# Altium schematic sheet ControllableSource1.SchDoc
size A4; DocumentNumber: 1; SheetNumber: 1; SheetTotal: 1
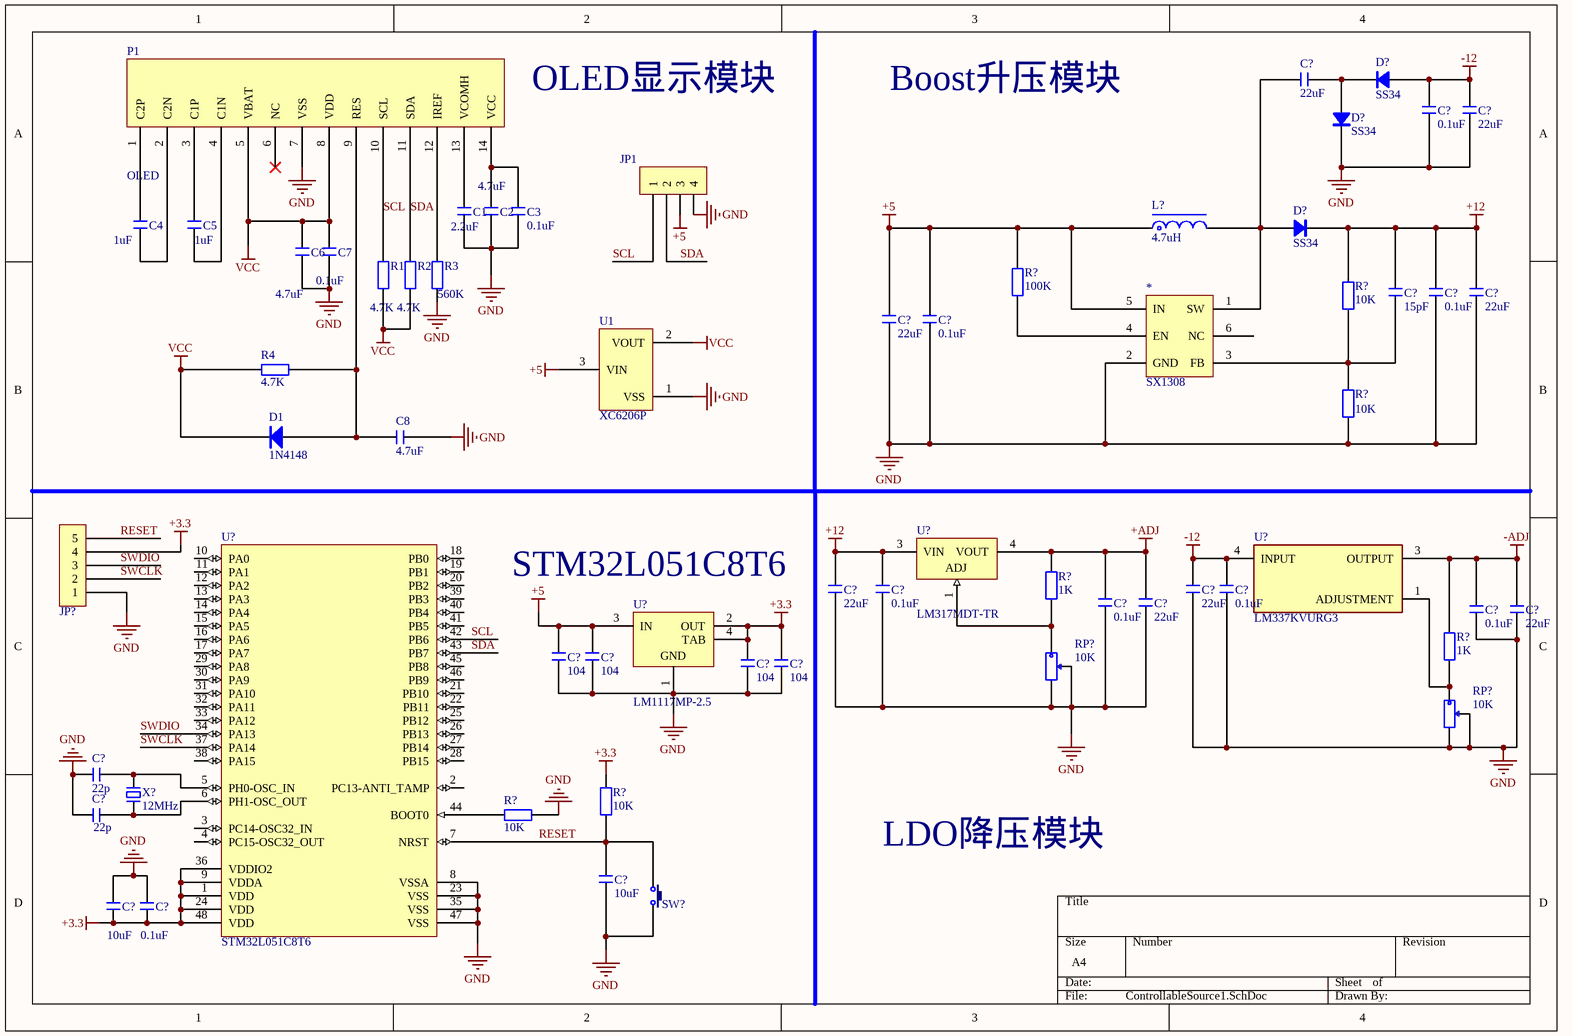
[diagram p0: ControllableSource1.SchDoc]

## Parts
(Parts that share a designator on the sheet are numbered #1, #2 ... from top to bottom, then left to right.)
*  SX1308  [SOT23-6N]
C1  2.2uF  [C 0805_L]
C2  4.7uF  [C 0805_L]
C3  0.1uF  [C 0805_L]
C4  1uF  [C 0805_L]
C5  1uF  [C 0805_L]
C6  4.7uF  [C 0805_L]
C7  0.1uF  [C 0805_L]
C8  4.7uF  [C 0805_L]
C?#1  22uF  [C 0805_L]
C?#2  0.1uF  [C 0805_L]
C?#3  22uF  [C 0805_L]
C?#4  15pF  [C 0805_L]
C?#5  0.1uF  [C 0805_L]
C?#6  22uF  [C 0805_L]
C?#7  22uF  [C 0805_L]
C?#8  0.1uF  [C 0805_L]
C?#9  22uF  [C 0805_L]
C?#10  0.1uF  [C 0805_L]
C?#11  22uF  [C 0805_L]
C?#12  0.1uF  [C 0805_L]
C?#13  0.1uF  [C 0805_L]
C?#14  22uF  [C 0805_L]
C?#15  0.1uF  [C 0805_L]
C?#16  22uF  [C 0805_L]
C?#17  104  [C 0805_L]
C?#18  104  [C 0805_L]
C?#19  104  [C 0805_L]
C?#20  104  [C 0805_L]
C?#21  22p  [C 0805_L]
C?#22  22p  [C 0805_L]
C?#23  10uF  [C 0805_L]
C?#24  10uF  [C 0805_L]
C?#25  0.1uF  [C 0805_L]
D1  1N4148  [MINI_MELF (LL34)]
D?#1  SS34  [SMC]
D?#2  SS34  [SMC]
D?#3  SS34  [SMC]
JP1  HDR-1X4  [XH2.54-WI-4P]  (value not drawn)
JP?  HDR-1X5  [XH2.54-WI-5P]  (value not drawn)
L?  4.7uH  [CD31]
P1  OLED  [OLED]
R1  4.7K  [R 0805_L]
R2  4.7K  [R 0805_L]
R3  560K  [R 0805_L]
R4  4.7K  [R 0805_L]
R?#1  100K  [R 0805_L]
R?#2  10K  [R 0805_L]
R?#3  10K  [R 0805_L]
R?#4  1K  [R 0805_L]
R?#5  1K  [R 0805_L]
R?#6  10K  [R 0805_L]
R?#7  10K  [R 0805_L]
RP?#1  10K  [3303W]
RP?#2  10K  [3303W]
SW?  3x6x5  [TSW SMD-3*6*2.5]  (value not drawn)
U1  XC6206P  [SOT23-3M]
U?#1  LM317MDT-TR  [TO-252_L]
U?#2  STM32L051C8T6  [STM-LQFP48_L]
U?#3  LM337KVURG3  [FP-KVU0003A-MFG]
U?#4  LM1117MP-2.5  [MP04A_L]
X?  12MHz  [OSC HC-49S]

## Nets
+3.3: C?#19.2 C?#20.2 C?#24.1 C?#25.1 JP?.4 R?#7.2 U?#2.1(VDD) U?#2.9(VDDA) U?#2.24(VDD) U?#2.36(VDDIO2) U?#2.48(VDD) U?#4.2(OUT) U?#4.4(TAB)
+5: *.5(IN) C?#7.2 C?#8.2 C?#17.2 C?#18.2 JP1.3 L?.1 R?#1.2 U1.3(VIN) U?#4.3(IN)
+12: C?#4.2 C?#5.2 C?#6.2 C?#9.2 C?#10.2 D?#3.2(K) R?#2.2 U?#1.3(VIN)
+ADJ: C?#13.2 C?#14.2 R?#4.2 U?#1.4(VOUT)
-12: C?#2.2 C?#3.2 C?#11.2 C?#12.2 D?#1.1(A) U?#3.4(INPUT)
-ADJ: C?#15.2 C?#16.2 R?#5.2 U?#3.3(OUTPUT)
GND: *.2(GND) C1.1 C2.1 C3.1 C6.1 C7.1 C8.2 C?#2.1 C?#3.1 C?#5.1 C?#6.1 C?#7.1 C?#8.1 C?#9.1 C?#10.1 C?#11.1 C?#12.1 C?#13.1 C?#14.1 C?#15.1 C?#16.1 C?#17.1 C?#18.1 C?#19.1 C?#20.1 C?#21.1 C?#22.1 C?#23.1 C?#24.2 C?#25.2 D?#2.2(K) JP1.4 JP?.1 P1.7(VSS) R3.1 R?#3.1 R?#6.2 RP?#1.2 RP?#1.3 RP?#2.2 RP?#2.3 SW?.2 U1.1(VSS) U?#2.8(VSSA) U?#2.23(VSS) U?#2.35(VSS) U?#2.47(VSS) U?#4.1(GND)
VCC: C6.2 C7.2 D1.2(K) P1.5(VBAT) P1.8(VDD) R1.1 R2.1 R4.1 U1.2(VOUT)
RESET: C?#23.2 JP?.5 R?#7.1 SW?.1 U?#2.7(NRST)
SCL: JP1.1 P1.10(SCL) R1.2 U?#2.42(PB6)
SDA: JP1.2 P1.11(SDA) R2.2 U?#2.43(PB7)
SWCLK: JP?.2 U?#2.37(PA14)
SWDIO: JP?.3 U?#2.34(PA13)
Net*_1: *.1(SW) C?#1.1 D?#3.1(A) L?.2
Net*_3: *.3(FB) C?#4.1 R?#2.1 R?#3.2
Net*_4: *.4(EN) R?#1.1
NetC1_2: C1.2 P1.13(VCOMH)
NetC2_2: C2.2 C3.2 P1.14(VCC)
NetC4_1: C4.1 P1.2(C2N)
NetC4_2: C4.2 P1.1(C2P)
NetC5_1: C5.1 P1.4(C1N)
NetC5_2: C5.2 P1.3(C1P)
NetC8_1: C8.1 D1.1(A) P1.9(RES) R4.2
NetC?#1_2: C?#1.2 D?#1.2(K) D?#2.1(A)
NetC?#21_2: C?#21.2 U?#2.5(PH0-OSC_IN) X?.2
NetC?#22_2: C?#22.2 U?#2.6(PH1-OSC_OUT) X?.1
NetP1_12: P1.12(IREF) R3.2
NetR?#4_1: R?#4.1 RP?#1.1 U?#1.1(ADJ)
NetR?#5_1: R?#5.1 RP?#2.1 U?#3.1(ADJUSTMENT)
NetR?#6_1: R?#6.1 U?#2.44(BOOT0)

Not connected (* = marked no-connect by the designer): * 6(NC); P1 6(NC)*; U?#2 2(PC13-ANTI_TAMP) 3(PC14-OSC32_IN) 4(PC15-OSC32_OUT) 10(PA0) 11(PA1) 12(PA2) 13(PA3) 14(PA4) 15(PA5) 16(PA6) 17(PA7) 18(PB0) 19(PB1) 20(PB2) 21(PB10) 22(PB11) 25(PB12) 26(PB13) 27(PB14) 28(PB15) 29(PA8) 30(PA9) 31(PA10) 32(PA11) 33(PA12) 38(PA15) 39(PB3) 40(PB4) 41(PB5) 45(PB8) 46(PB9)

## Notes on the sheet
- (near P1) OLED显示模块
- Boost升压模块
- (near U?#4) STM32L051C8T6
- LDO降压模块

## Library data of the parts
C1-C8 C?#1-C?#25 = C: 无极性贴片电容; 材质: X7R; BOM名称: 无极性贴片电容
D1 = 1N4148: 高速开关二极管; BOM名称: 高速开关二极管
D?#1-D?#3 = SS34: 肖特基二极管; 属性: 40V/3A; BOM名称: 肖特基二极管
JP1 = Header 4: 4P接插件; BOM名称: 4P接插件
JP? = Header 5: 5P接插件; BOM名称: 5P接插件
L? = L-CD: 贴片功率电感; BOM名称: 功率电感
R1-R4 R?#1-R?#7 = R: 贴片电阻; BOM名称: 贴片电阻
RP?#1 RP?#2 = RP-SMD: 贴片电位器; BOM名称: 贴片电位器
SW? = TSW 3x6: 3x6轻触开关; BOM名称: 3x6轻触开关
U?#1 = CMP-0244-00074-1: 500mA, Medium Current 1.2 to 37 V Adjustable Voltage Regulator, 3-Pin DPAK, Tape and Reel; DatasheetVersion: 1/02/2008; ComponentLink1Description: Manufacturer URL; PackageReference: TO-252; ComponentLink2Description: Datasheet; PackageDescription: 3-Pin Transistor Outline Package 2.28 mm Pitch, 9.7 mm Lead Span (DPAK); ComponentLink2URL: http://www.st.com/internet/com/TECHNICAL_RESOURCES/TECHNICAL_LITERATURE/DATASHEET/CD00000549.pdf; PackageVersion: 2011; ComponentLink1URL: http://www.st.com
U?#2 = CMP-1546-00003-1: Ultra-Low-Power ARM Cortex-M0+ MCU, 64 KB Flash, 1.8 to 3.6 V, -40 to 85 degC, 48-Pin LQFP, RoHS, Tray; RAM: 8 KB; Flash: 64 KB; Data EEPROM: 2 KB; VDD Max: 3.6 V; VDD Min: 1.8 V; PartNumber: STM32L051C8T6; ComponentLink3URL: http://www.st.com/st-web-ui/static/active/en/resource/technical/document/datasheet/DM00058181.pdf; ComponentLink1URL: http://www.st.com/web/en/home.html; Temperature Min: -40 degC; DatasheetVersion: Rev. 4; ComponentLink3Description: Package Specification; Mounting Technology: Surface Mount; ComponentLink1Description: Manufacturer URL; Packing: Tray; Temperature Max: 85 degC; ComponentLink2URL: http://www.st.com/st-web-ui/static/active/en/resource/technical/document/datasheet/DM00108219.pdf; PackageDescription: 48-Pin Frame Chip Scale Package, Body 7 x 7 mm, Pitch 0.5 mm; ComponentLink2Description: Datasheet; RoHS: TRUE
U?#3 = CMP-04917-000160-1: IC REG LIN NEG ADJ 1.5A TO252-3; Max Input Voltage: -40V; Min Input Voltage: -4.2V; Number of Regulators: 1; Quiescent Current: 1.5mA; Output Type: Adjustable; Max Output Voltage: -1.2V; Polarity: Negative; Min Output Voltage: -37V; Power Supply Rejection Ratio (PSRR): 77dB; Reference Voltage: -1.287V; RoHS Compliant: Yes; Lead Free: Lead Free; Min Current Limit: 1.5A; Radiation Hardening: No; Number of Pins: 3; Case/Package: TO-252-3; REACH SVHC: No SVHC; Package Quantity: 1; Packaging: Tape and Reel; Min Operating Temperature: 0°C; Output Current: 1.5A; Weight: 0.011598oz; Output Voltage: -37V; Mount: Surface Mount; Series: -; Max Operating Temperature: 125°C; Number of Outputs: 1; Contact Plating: Tin; Max Output Current: 1.5A
U?#4 = CMP-0062-01651-3: 800mA Low-Dropout Linear Regulator, 4-pin SOT-223; Manufacturer: National Semiconductor; PowerWise: N; High-Reliability: Y; PackageTopMarking: XYTT*N13A; CompType: LDO IC; PackageReference: MP04A; ComponentLink3Description: LM1117 Web Page; PinCount: 4; ComponentLink2URL: http://www.national.com/ds/LM/LM1117.pdf; PartNumber: LM1117MP-2.5; ComponentLink1Description: Manufacturer URL; RevisionNote: SCH symbol layout adjusted; Code_JEDEC: TO-261-AA; Code_IPC: SOT223-4; ComponentLink2Description: LM1117 Datasheet; ComponentLink3URL: http://www.national.com/pf/LM/LM1117.html; DatasheetVersion: Apr-2006; ComponentLink4Description: MP04A Package Page; ComponentLink1URL: http://www.national.com/; RoHS: N; PackageVersion: revB, Apr-2003; PackageDescription: Molded SOT-223, 6.50 x 3.56 x 1.6mm Body, 4 Lead, 2.3mm Pitch; ComponentLink4URL: http://www.national.com/packaging/folders/mp04a.html
X? = XTAL-2P: 2脚无源脚晶振; 负载电容: CL20pF; BOM名称: 2脚无源脚晶振